# Altium schematic sheet rpi.SchDoc: Raspberry PI Interface
size A4; Organization: heig-vd; Address1: heig-vd; Address2: Route de Cheseaux 1; Address3: 1401 Yverdon-les-Bains; Address4: Suisse; DocumentNumber: 2; Revision: 1.1; SheetNumber: 2; SheetTotal: 12
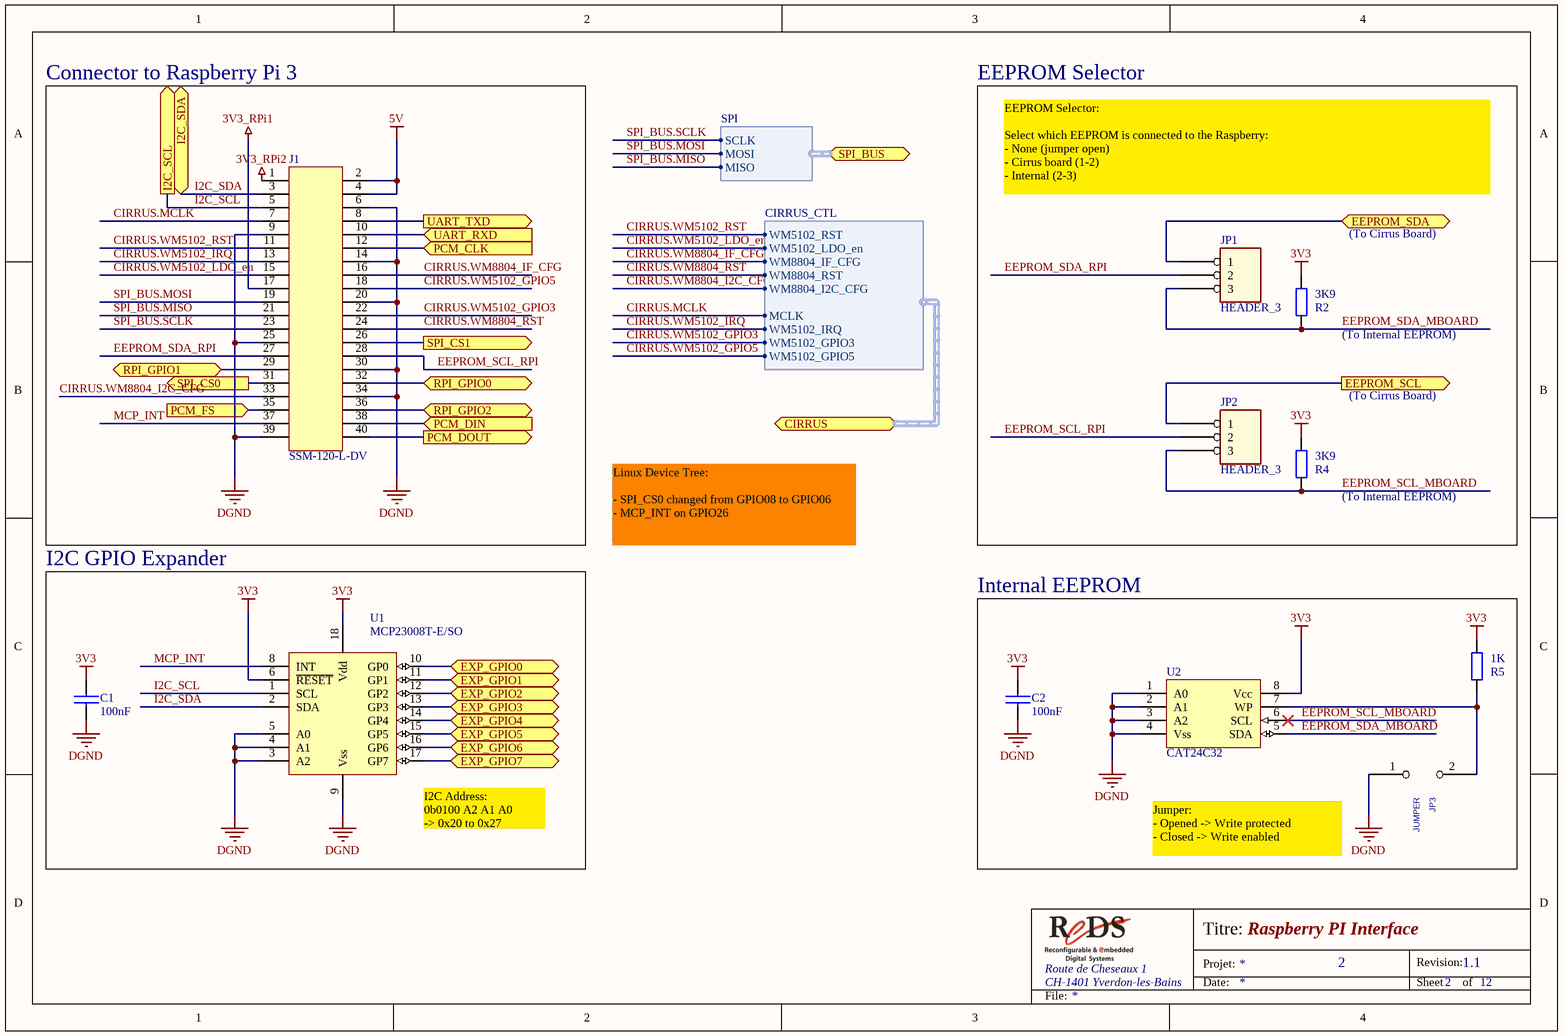
[diagram p0: rpi.SchDoc]

## Parts
C1  100nF  [SM/C_0603]
C2  100nF  [SM/C_0603]
J1  SSM-120-L-DV  [SSM-120]
JP1  HEADER_3  [BLKCON.100/VH/TM1SQ/W.100/3]
JP2  HEADER_3  [BLKCON.100/VH/TM1SQ/W.100/3]
JP3  JUMPER  [BLKCON.100/VH/TM1SQ/W.100/2]
R2  3K9  [SM/R_0603]
R4  3K9  [SM/R_0603]
R5  1K  [SM/R_0603]
U1  MCP23008T-E/SO  [SOIC-18 - W]
U2  CAT24C32  [SOIC-8 - N]

## Blocks framed on the sheet
Connector to Raspberry Pi 3: J1
EEPROM Selector: JP1 JP2 R2 R4
I2C GPIO Expander: C1 U1
Internal EEPROM: C2 JP3 R5 U2

## Ports
CIRRUS (harness CIRRUS_CTL), EEPROM_SCL (out), EEPROM_SDA (bidir), EXP_GPIO0 (bidir), EXP_GPIO1 (bidir), EXP_GPIO2 (bidir), EXP_GPIO3 (bidir), EXP_GPIO4 (bidir), EXP_GPIO5 (bidir), EXP_GPIO6 (bidir), EXP_GPIO7 (bidir), I2C_SCL (out), I2C_SDA (bidir), PCM_CLK (in), PCM_DIN (in), PCM_DOUT (out), PCM_FS (in), RPI_GPIO0 (bidir), RPI_GPIO1 (bidir), RPI_GPIO2 (bidir), SPI_BUS (harness SPI), SPI_CS0 (out), SPI_CS1 (out), UART_RXD (in), UART_TXD (out)

## Harnesses
CIRRUS_CTL: WM5102_RST, WM5102_LDO_en, WM8804_IF_CFG, WM8804_RST, WM8804_I2C_CFG, MCLK, WM5102_IRQ, WM5102_GPIO3, WM5102_GPIO5
SPI: SCLK, MOSI, MISO

## Nets
3V3: C1.1 C2.1 R2.1 R4.1 R5.1 U1.6(~{RESET}) U1.18(Vdd) U2.8(Vcc)
3V3_RPi1: J1.17
3V3_RPi2: J1.1
5V: J1.2 J1.4
DGND: C1.2 C2.2 J1.6 J1.9 J1.14 J1.20 J1.25 J1.30 J1.34 J1.39 JP3.1 U1.3(A2) U1.4(A1) U1.5(A0) U1.9(Vss) U2.1(A0) U2.2(A1) U2.3(A2) U2.4(Vss)
CIRRUS.MCLK: J1.7 ; port CIRRUS.MCLK
CIRRUS.WM5102_GPIO3: J1.22 ; port CIRRUS.WM5102_GPIO3
CIRRUS.WM5102_GPIO5: J1.18 ; port CIRRUS.WM5102_GPIO5
CIRRUS.WM5102_IRQ: J1.13 ; port CIRRUS.WM5102_IRQ
CIRRUS.WM5102_LDO_en: J1.15 ; port CIRRUS.WM5102_LDO_en
CIRRUS.WM5102_RST: J1.11 ; port CIRRUS.WM5102_RST
CIRRUS.WM8804_I2C_CFG: J1.33 ; port CIRRUS.WM8804_I2C_CFG
CIRRUS.WM8804_IF_CFG: J1.16 ; port CIRRUS.WM8804_IF_CFG
CIRRUS.WM8804_RST: J1.24 ; port CIRRUS.WM8804_RST
EEPROM_SCL: JP2.1 ; port EEPROM_SCL
EEPROM_SCL_MBOARD: JP2.3 R4.2 U2.6(SCL)
EEPROM_SCL_RPI: J1.28 JP2.2
EEPROM_SDA: JP1.1 ; port EEPROM_SDA
EEPROM_SDA_MBOARD: JP1.3 R2.2 U2.5(SDA)
EEPROM_SDA_RPI: J1.27 JP1.2
EXP_GPIO0: U1.10(GP0) ; port EXP_GPIO0
EXP_GPIO1: U1.11(GP1) ; port EXP_GPIO1
EXP_GPIO2: U1.12(GP2) ; port EXP_GPIO2
EXP_GPIO3: U1.13(GP3) ; port EXP_GPIO3
EXP_GPIO4: U1.14(GP4) ; port EXP_GPIO4
EXP_GPIO5: U1.15(GP5) ; port EXP_GPIO5
EXP_GPIO6: U1.16(GP6) ; port EXP_GPIO6
EXP_GPIO7: U1.17(GP7) ; port EXP_GPIO7
I2C_SCL: J1.5 U1.1(SCL) ; port I2C_SCL
I2C_SDA: J1.3 U1.2(SDA) ; port I2C_SDA
MCP_INT: J1.37 U1.8(INT)
PCM_CLK: J1.12 ; port PCM_CLK
PCM_DIN: J1.38 ; port PCM_DIN
PCM_DOUT: J1.40 ; port PCM_DOUT
PCM_FS: J1.35 ; port PCM_FS
RPI_GPIO0: J1.32 ; port RPI_GPIO0
RPI_GPIO1: J1.29 ; port RPI_GPIO1
RPI_GPIO2: J1.36 ; port RPI_GPIO2
SPI_BUS.MISO: J1.21 ; port SPI_BUS.MISO
SPI_BUS.MOSI: J1.19 ; port SPI_BUS.MOSI
SPI_BUS.SCLK: J1.23 ; port SPI_BUS.SCLK
SPI_CS0: J1.31 ; port SPI_CS0
SPI_CS1: J1.26 ; port SPI_CS1
UART_RXD: J1.10 ; port UART_RXD
UART_TXD: J1.8 ; port UART_TXD
NetJP3_2: JP3.2 R5.2 U2.7(WP)

## Notes on the sheet
- EEPROM Selector:
  Select which EEPROM is connected to the Raspberry:
  - None (jumper open)
  - Cirrus board (1-2)
  - Internal (2-3)
- (To Cirrus Board)
- (near R2) (To Internal EEPROM)
- (near R4) (To Internal EEPROM)
- Linux Device Tree:
  - SPI_CS0 changed from GPIO08 to GPIO06
  - MCP_INT on GPIO26
- (near U1) I2C Address:
  0b0100 A2 A1 A0
  -> 0x20 to 0x27
- Jumper:
  - Opened -> Write protected
  - Closed -> Write enabled
- Route de Cheseaux 1
- CH-1401 Yverdon-les-Bains
- Titre:
- Date:
- Projet:
- Revision:
- Sheet
- of
- File:

## Library data of the parts
C1 C2 = 182: Ceramic multi-layer; Manufacturer: AVX; Manufacturer P/N: 0603YC104KAZ2A; ID: 182; Voltage: 16V; Tolerance: ±10%; Value: 100nF; Component Type: Capacitor, non-polarized; Supplier 1: Farnell; Supplier Part Number 1: 7569556; RoHS Compliant: True
J1 = SSM-120-L-DV: Mating (female) connector for the RPi 3
JP1 JP2 = 41: Barrette simple 3 poles 2.54mm; Manufacturer: TE Connectivity; Manufacturer P/N: 5-826629-0; ID: 41; Connector Type: Barrette 2.54mm; Component Type: Barrette 2.54mm; Supplier 1: Distrelec; Supplier Part Number 1: 122354; ComponentLink1Description: Datasheet; ComponentLink1URL: #https://www.distrelec.ch/ishop/Datasheets/eh826629_draw.pdf#; ComponentLink2Description: Supplier; ComponentLink2URL: https://www.distrelec.ch/barrette-%C3%A0-broches-50-p%C3%B4les-1p-x50/te-connectivity/5-826629-0/122354/fr; RoHS Compliant1: False
JP3 = 102: Barrette simple 2 poles 2.54mm; Manufacturer: TE Connectivity; Manufacturer P/N: 5-826629-0; ID: 102; Connector Type: Barrette 2.54mm; Component Type: Jumper; Supplier 1: Distrelec; Supplier Part Number 1: 122354; ComponentLink1Description: Datasheet; ComponentLink1URL: #https://www.distrelec.ch/ishop/Datasheets/eh826629_draw.pdf#; ComponentLink2Description: Supplier; ComponentLink2URL: https://www.distrelec.ch/barrette-%C3%A0-broches-50-p%C3%B4les-1p-x50/te-connectivity/5-826629-0/122354/fr; RoHS Compliant1: False
R2 R4 = 123: Résistance 0603 63mW 1% 3K9; Manufacturer: Multicomp; Manufacturer P/N: MC 0.036mW 0603 1% 3K9; ID: 123; Voltage: 50V; Value: 3K9; Component Type: Résistance; Power: 63mW; Tolerance: 1%; Supplier 1: Farnell; Supplier Part Number 1: 9331140; RoHS Compliant: False
R5 = 109: Résistance 0603 63mW 1% 1K; Manufacturer: Multicomp; Manufacturer P/N: MC 0.036mW 0603 1% 1K; ID: 109; Voltage: 50V; Value: 1K; Component Type: Résistance; Power: 63mW; Tolerance: 1%; Supplier 1: Farnell; Supplier Part Number 1: 9330380; RoHS Compliant: False
U1 = MCP23008T-E/SO: 8-Bit I/O Expander with Serial Interface (SOIC); Supplier 1: Mouser; Supplier 2: Farnell; Supplier 3: Digi-Key; Supplier 4: Arrow; Supplier Part Number 1: 579-MCP23008T-E/SO; Supplier Part Number 2: 1332086; Supplier Part Number 3: MCP23008T-E/SODKR-ND; Supplier Part Number 4: z9HrPUYC-Z_kvHyipgUSB4v0Qz4-3ABI9jppHtpV0FM
U2 = CAT24C32W: 32-Kb I2C CMOS Serial  EEPROM; Supplier 1: Farnell; Supplier 2: Mouser; Supplier 3: Newark; Supplier 4: Digi-Key; Supplier 5: Digi-Key; Supplier 6: Digi-Key; Supplier 7: Newark; Supplier 8: Farnell; Supplier 9: Arrow; Supplier 10: Mouser; Supplier 11: Arrow; Supplier Part Number 1: 1718129; Supplier Part Number 2: 698-CAT24C32WI-GT3; Supplier Part Number 3: 08R5414; Supplier Part Number 4: CAT24C32WI-GT3CT-ND; Supplier Part Number 5: CAT24C32WI-GOS-ND; Supplier Part Number 6: CAT24C32WI-GT3DKR-ND; Supplier Part Number 7: 06R0560; Supplier Part Number 8: 1631139; Supplier Part Number 9: VnlsYlhtkEtjJb7ddmB954M0cIWzK2n6cXeSPF3m92I; Supplier Part Number 10: 698-CAT24C32WI-G; Supplier Part Number 11: VnlsYlhtkEtjJb7ddmB95zFhSL4MLJyM6Ic6OekJsHY